# Altium schematic sheet [01] - POWER SUPPLY.SchDoc: Desk Digital Clock
size A2; DrawnBy: Ramil Teregulov; Address1: http://github.com/teregulov; Address2: http://github.com/teregulov/Desk-Digital-Clock; DocumentNumber: DDC-5; Revision: 1R0; SheetNumber: 5; SheetTotal: 7
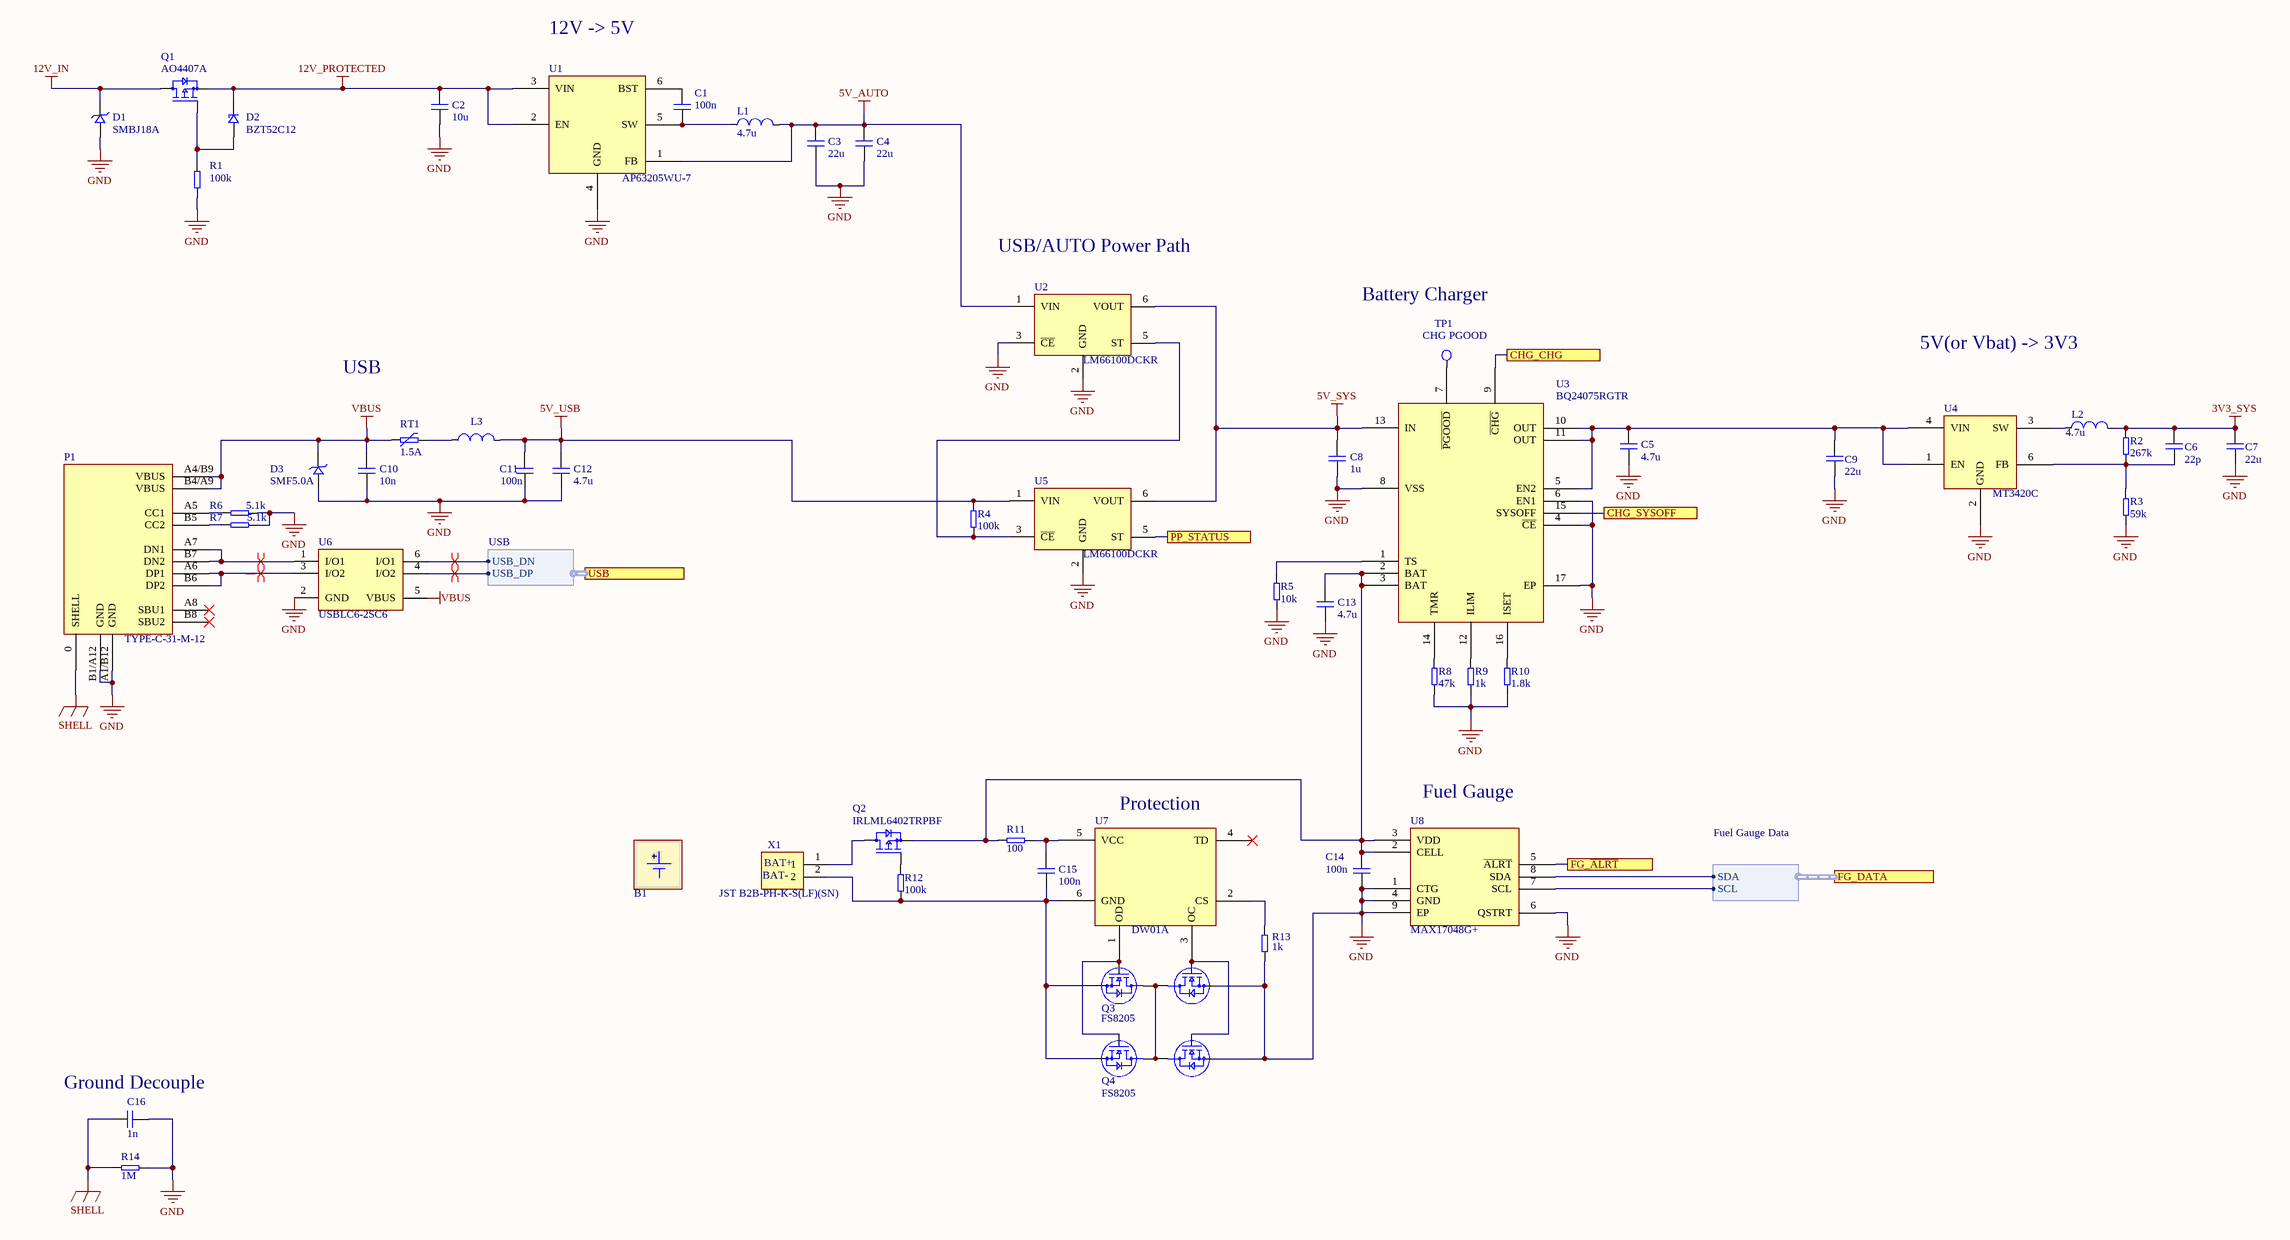
[diagram p0: [01] - POWER SUPPLY.SchDoc]

## Parts
B1  (no value)  (mechanical)
C1  100n  [C0603]
C2  10u  [C1206]
C3  22u  [C1206]
C4  22u  [C1206]
C5  4.7u  [C0603]
C6  22p  [C0603]
C7  22u  [C1210]
C8  1u  [C0603]
C9  22u  [C1210]
C10  10n  [C0603]
C11  100n  [C0603]
C12  4.7u  [C0603]
C13  4.7u  [C0603]
C14  100n  [C0603]
C15  100n  [C0603]
C16  1n  [C0603]
D1  SMBJ18A  [SMBJ18A]
D2  BZT52C12  [BZT52C12]
D3  SMF5.0A  [SSMF5.0A OD-123FL]
L1  4.7u  [GSM0530-xxx-M Inductor]
L2  4.7u  [CDRH5D16]
L3  (no value)  [C0805]
P1  TYPE-C-31-M-12  [TYPE-C-31-M-12]
Q1  AO4407A  [UMW AO4407A]
Q2  IRLML6402TRPBF  [IRLML6402TRPBF]
Q3  FS8205  [SOT23-6-MT3420C]
Q4  FS8205  [SOT23-6-MT3420C]
R1  100k  [R0603]
R2  267k  [R0603]
R3  59k  [R0603]
R4  100k  [R0603]
R5  10k  [R0603]
R6  5.1k  [R0603]
R7  5.1k  [R0603]
R8  47k  [R0603]
R9  1k  [R0603]
R10  1.8k  [R0603]
R11  100  [R0603]
R12  100k  [R0603]
R13  1k  [R0603]
R14  1M  [R0603]
RT1  value 1.5A  [MF-MSMF150]  (hidden comment: MF-MSMF150-2)
TP1  Test Point Name: CHG PGOOD  [Test Point 1.6 mm]  (hidden comment: Test Point)  (no BOM)
U1  AP63205WU-7  [TAP63200/AP63201/AP63203/AP63205 SOT26]
U2  LM66100DCKR  [LM66100DCKR]
U3  BQ24075RGTR  [BQ24072 BQ24073 BQ24074 BQ24075 BQ24079]
U4  MT3420C  [SOT23-6-MT3420C]
U5  LM66100DCKR  [LM66100DCKR]
U6  USBLC6-2SC6  [SOT23-6L-USBLC6-2SC6]
U7  DW01A  [SOT23-6-MT3420C]
U8  MAX17048G+  [MAXIM MAX17048G+T10]
X1  JST B2B-PH-K-S(LF)(SN)  [B2B -PH-K-S]

## Ports
CHG_CHG, CHG_SYSOFF, FG_DATA (harness Fuel Gauge Data), FG_~{ALRT}, PP_STATUS, USB (harness USB)

## Harnesses
Fuel Gauge Data: SDA, SCL
USB: USB_DP, USB_DN

## Nets
3V3_SYS: C6.2 C7.2 L2.2 R2.2
5V_AUTO: C3.2 C4.2 L1.2 U1.1(FB) U2.1(VIN)
5V_SYS: C8.2 U2.6(VOUT) U3.13(IN) U5.6(VOUT)
5V_USB: C11.2 C12.2 L3.2 R4.1 U5.1(VIN)
12V_IN: D1.1 Q1.D
12V_PROTECTED: C2.2 D2.1 Q1.S U1.2(EN) U1.3(VIN)
GND: C2.1 C3.1 C4.1 C5.1 C7.1 C8.1 C9.1 C10.1 C11.1 C12.1 C13.1 C14.1 C16.1 D1.2 D3.2 P1.A1/B12(GND) P1.B1/A12(GND) Q3.3(S2) Q4.3(S2) R1.2 R3.1 R5.2 R6.1 R7.1 R8.2 R9.2 R10.2 R13.1 R14.2 U1.4(GND) U2.2(GND) U2.3(~{CE}) U3.4(~{CE}) U3.6(EN1) U3.8(VSS) U3.17(EP) U4.2(GND) U5.2(GND) U6.2(GND) U8.1(CTG) U8.4(GND) U8.6(QSTRT) U8.9(EP)
SHELL: C16.2 P1.0(SHELL) R14.1
VBUS: C10.2 D3.1 P1.A4/B9(VBUS) P1.B4/A9(VBUS) RT1.1 U6.5(VBUS)
CHG_CHG: U3.9(~{CHG}) ; port CHG_CHG
CHG_SYSOFF: U3.15(SYSOFF) ; port CHG_SYSOFF
FG_~{ALRT}: U8.5(~{ALRT}) ; port FG_~{ALRT}
PP_STATUS: U5.5(ST) ; port PP_STATUS
NetC1_1: C1.1 L1.1 U1.5(SW)
NetC1_2: C1.2 U1.6(BST)
NetC5_2: C5.2 C9.2 U3.5(EN2) U3.10(OUT) U3.11(OUT) U4.1(EN) U4.4(VIN)
NetC6_1: C6.1 R2.1 R3.2 U4.6(FB)
NetC13_2: C13.2 C14.2 Q2.2 R11.2 U3.2(BAT) U3.3(BAT) U8.2(CELL) U8.3(VDD)
NetC15_1: C15.1 Q3.1(S1) Q4.1(S1) R12.2 U7.6(GND) X1.2
NetC15_2: C15.2 R11.1 U7.5(VCC)
NetD2_2: D2.2 Q1.G R1.1
NetL2_1: L2.1 U4.3(SW)
NetL3_1: L3.1 RT1.2
NetP1_A5: P1.A5(CC1) R6.2
NetP1_A6: P1.A6(DP1) P1.B6(DP2) U6.3(I/O2)
NetP1_A7: P1.A7(DN1) P1.B7(DN2) U6.1(I/O1)
NetP1_B5: P1.B5(CC2) R7.2
NetQ2_1: Q2.1 R12.1
NetQ2_3: Q2.3 X1.1
NetQ3_2: Q3.2(D12) Q3.5(D12) Q4.2(D12) Q4.5(D12)
NetQ3_4: Q3.4(G2) Q4.4(G2) U7.3(OC)
NetQ3_6: Q3.6(G1) Q4.6(G1) U7.1(OD)
NetR4_2: R4.2 U2.5(ST) U5.3(~{CE})
NetR5_1: R5.1 U3.1(TS)
NetR8_1: R8.1 U3.14(TMR)
NetR9_1: R9.1 U3.12(ILIM)
NetR10_1: R10.1 U3.16(ISET)
NetR13_2: R13.2 U7.2(CS)
NetTP1_1: TP1.1 U3.7(~{PGOOD})
NetU6_4: U6.4(I/O2) ; port USB.USB_DP
NetU6_6: U6.6(I/O1) ; port USB.USB_DN
NetU8_7: U8.7(SCL) ; port FG_DATA.SCL
NetU8_8: U8.8(SDA) ; port FG_DATA.SDA

Not connected (* = marked no-connect by the designer): P1 A8(SBU1)* B8(SBU2)*; U7 4(TD)*

## Layout directives
differential pair: NetP1_A6, NetP1_A7, NetU6_4, NetU6_6

## Notes on the sheet
- 12V -> 5V
- USB/AUTO Power Path
- Battery Charger
- USB
- 5V(or Vbat) -> 3V3
- (near U7) Protection
- (near U8) Fuel Gauge
- (near X1) BAT-
- (near X1) BAT+
- (near C16) Ground Decouple
- Title:
- Size:
- Date:
- A4
- Number:
- Time:
- Revision:
- Sheet
- of
- File:

## Library data of the parts
B1 = Bat: BATTERY
C1-C16 = Cap: CAPACITOR
  C1 C11 C14 C15: Value: 100n
  C2: Value: 10u
  C3 C4 C7 C9: Value: 22u
  C5 C12 C13: Value: 4.7u
  C6: Value: 22p
  C8: Value: 1u
  C10: Value: 10n
  C16: Value: 1n
D1 = SMBJ18A: TVS DIODE 18VWM 29.2VC SMB; Manufacturer: Jingdao Microelectronics; HelpURL: https://www.lcsc.com/datasheet/C353379.pdf?spm=wm.sxq.inf.ggs___wm.fly.bg.1.xh&lcsc_vid=EQRaUgBURlNYUgcERQILVVIEQ1gIVldeRllcAwAFQQMxVlNeR1NcUFFVQVVWVDsOAxUeFF5JWBYZEEoKFBINSQcJGk4dAgUUFAk%3D; P/N: SMBJ18A
D2 = BZT52C12: DIODE ZENER 12V 500mW SOD-123; Manufacturer: GOODWORK; HelpURL: https://www.lcsc.com/datasheet/C2932744.pdf?spm=wm.sxq.inf.ggs___wm.fly.bg.1.xh&lcsc_vid=EQRaUgBURlNYUgcERQILVVIEQ1gIVldeRllcAwAFQQMxVlNeR1NcUVVQTlheVDsOAxUeFF5JWBYZEEoKFBINSQcJGk4eFQsCAgIaSgADAwAHC0slRVlaVlBeRU8GEwkK; P/N: BZT52C12
D3 = SMF5.0A: TVS DIODE 5VWM 9.2VC SOD-123FL; Manufacturer: Littelfuse; HelpURL: https://www.lcsc.com/datasheet/C151296.pdf?spm=wm.sxq.inf.ggs___wm.fly.bg.0.xh&lcsc_vid=EQRaUgBURlNYUgcERQILVVIEQ1gIVldeRllcAwAFQQMxVlNeR1BZVV1RTlhdVDsOAxUeFF5JWBYZEEoKFBINSQcJGk4NBhADEA4cHkteQ1NADxALGw%3D%3D; P/N: SMF5.0A
L1 = GSM0530-4R7-M: FIXED IND 4.7uH 4.5A 54mΩ SMD,5.7x5.2mm; P/N: GSM0530-4R7-M; HelpURL: https://www.lcsc.com/datasheet/C51933829.pdf?spm=wm.sxq.inf.ggs___wm.fly.bg.3.xh&lcsc_vid=EQRaUgBURlNYUgcERQILVVIEQ1gIVldeRllcAwAFQQMxVlNeR1NcVlZRQlBWXjsOAxUeFF5JWBYZEEoKFBINSQcJGk4eFQsCAgIaSgADAwAHC0slQlJaXlNWQk8GEwkK; Value: 4.7u
L2 = Ind: INDUCTOR; P/N: CDRH5D16NP-4R7NC; Value: 4.7u
L3 = Ind: Ferrite Bead; P/N: blm21pg221s
P1 = TYPE-C-31-M-12: CONN RCPT Type-C 16POS SMD; P/N: TYPE-C-31-M-12; HelpURL: https://www.lcsc.com/datasheet/C165948.pdf?spm=wm.sxq.inf.ggs___wm.fly.bg.0.xh&lcsc_vid=EQRaUgBURlNYUgcERQILVVIEQ1gIVldeRllcAwAFQQMxVlNeR1BYXlVUQlFaVjsOAxUeFF5JWBYZEEoKFBINSQcJGk4eFQsCAgIaSgADAwAHC0slRVNaUVNWTlZADxALGw%3D%3D
Q1 = AO4407A: MOSFET P-CH 30V 14A SOP-8; Manufacturer: UWM; P/N: AO4407A; Datasheet: https://www.lcsc.com/datasheet/C2841482.pdf?spm=wm.sxq.inf.ggs___wm.fly.bg.1.xh&lcsc_vid=EQRaUgBURlNYUgcERQILVVIEQ1gIVldeRllcAwAFQQMxVlNeR1NcU1xSQlJfVzsOAxUeFF5JWBYZEEoKFBINSQcJGk4eFQsCAgIaSgADAwAHC0slRldeUFZIHxUDCw%3D%3D; Package: SOP-8
Q2 = IRLML6402TRPBF: MOSFET P-CH 20V 3.7A SOT-23; Manufacturer: Infineon; P/N: IRLML6402TRPBF; Package: SOT-23
Q3 Q4 = FS8205: Dual n-Channel Enhancement Mode power MOSFET; Manufacturer: Fortune; P/N: FS8205; Datasheet: https://datasheet.lcsc.com/lcsc/1810110910_Fortune-Semicon-FS8205_C32254.pdf
R1-R14 = Res: RESISTOR
  R1 R4 R12: Value: 100k
  R2: Value: 267k
  R3: Value: 59k
  R5: Value: 10k
  R6 R7: Value: 5.1k
  R8: Value: 47k
  R9 R13: Value: 1k
  R10: Value: 1.8k
  R11: Value: 100
  R14: Value: 1M
RT1 = MF-MSMF150-2: PTC RESET FUSE 6V 1812; P/N: MF-MSMF150-2; ComponentLink1Description: HelpURL; ComponentLink1URL: https://www.lcsc.com/datasheet/C89648.pdf?spm=wm.sxq.inf.ggs___wm.fly.bg.0.xh&lcsc_vid=EQRaUgBURlNYUgcERQILVVIEQ1gIVldeRllcAwAFQQMxVlNeR1BZU1ReR1ldUTsOAxUeFF5JWBYZEEoKFBINSQcJGk4NBhADEA4cHktXR1BXSQwSGg0%3D
U1 = AP63205WU-7: 3.8V to 32V Input, 2A Low Quiescent Current Synchronous Buck Converter with Enhanced EMI Suppression; Manufacturer: DIODES; Datasheet: https://www.lcsc.com/datasheet/C2071056.pdf?spm=wm.sxq.inf.ggs___wm.fly.bg.0.xh&lcsc_vid=EQRaUgBURlNYUgcERQILVVIEQ1gIVldeRllcAwAFQQMxVlNeR1NfXlNVTlNXUDsOAxUeFF5JWBYZEEoKFBINSQcJGk4%3D; P/N: AP63205WU-7
U2 U5 = LM66100DCKR: Low IQ Ideal Diode With Input Polarity Protection; Manufacturer: TI; HelpURL: https://www.lcsc.com/datasheet/C2869734.pdf?spm=wm.sxq.inf.ggs___wm.fly.bg.0.xh&lcsc_vid=EQRaUgBURlNYUgcERQILVVIEQ1gIVldeRllcAwAFQQMxVlNeR1BZUlVeR1dfVzsOAxUeFF5JWBYZEEoKFBINSQcJGk4eFQsCAgIaSgADAwAHC0slT1hYU1xIHxUDCw%3D%3D; P/N: LM66100DCKR
U3 = BQ24075RGTR: 1.5A USB-FRIENDLY Li-lon BATTERY CHARGER AND POWER-PATH MANAGEMENT IC; Manufacturer: TI; HelpURL: https://www.lcsc.com/datasheet/C15464.pdf?spm=wm.sxq.inf.ggs___wm.fly.bg.0.xh&lcsc_vid=EQRaUgBURlNYUgcERQILVVIEQ1gIVldeRllcAwAFQQMxVlNeR1NcXlVXRlNaUzsOAxUeFF5JWBYZEEoKFBINSQcJGk4eFQsCAgIaSgADAwAHC0slQlFdUl1QWQkaCgg%3D; P/N: BQ24075RGTR
U4 = MT3420C: 2A 2.3-6V Input 1.5MHz Synchronous Step-Down Converter; Manufacturer: Aerosemi; Datasheet: https://datasheet.lcsc.com/lcsc/1806041635_XI-AN-Aerosemi-Tech-MT3420C_C181741.pdf; P/N: MT3420C
U6 = USBLC6-2SC6: TVS DIODE 5.25V 17V SOT23-6; Manufacturer: STMicroelectronics; Datasheet: https://www.st.com/content/ccc/resource/technical/document/datasheet/06/1d/48/9c/6c/20/4a/b2/CD00050750.pdf/files/CD00050750.pdf/jcr:content/translations/en.CD00050750.pdf; P/N: USBLC6-2SC6
U7 = DW01A: 2A 2.3-6V Input 1.5MHz Synchronous Step-Down Converter; Manufacturer: HMsemi; P/N: DW01A; HelpURL: https://hmsemi.com/downfile/DW01A.PDF
U8 = MAX17048G+T10: 1-Cell/2-Cell Fuel Gauge with ModelGauge; Manufacturer: Maxim Integrated; P/N: MAX17048G+; Datasheet: https://static.chipdip.ru/lib/542/DOC011542521.pdf
X1 = JST B2B-PH-K-S(LF)(SN): CONN HEADER TH 2POS 2mm; HelpURL: https://www.lcsc.com/datasheet/C131337.pdf?spm=wm.sxq.inf.ggs___wm.fly.bg.0.stp&lcsc_vid=FFBYBlcEFAQLVVJeQARWBFACRFUNUlFXRVlWBQJRRFkxVlNeR1NaVVVSQlRaUzsOAxUeFF5JWBYZEEoKFBINSQcJGk4dAgUUFAk%3D; Manufacturer: JST; P/N: JST B2B-PH-K-S(LF)(SN)